# EasyEDA schematic SCH_Nucleo扩展板_DAC8830_ADS8681_2022-10-27.json

## Sheets
1 连接器: TITLE: Sheet_1; REV: 1.0; Date: 2022-09-22; Sheet: 1/1; Company: Your Company
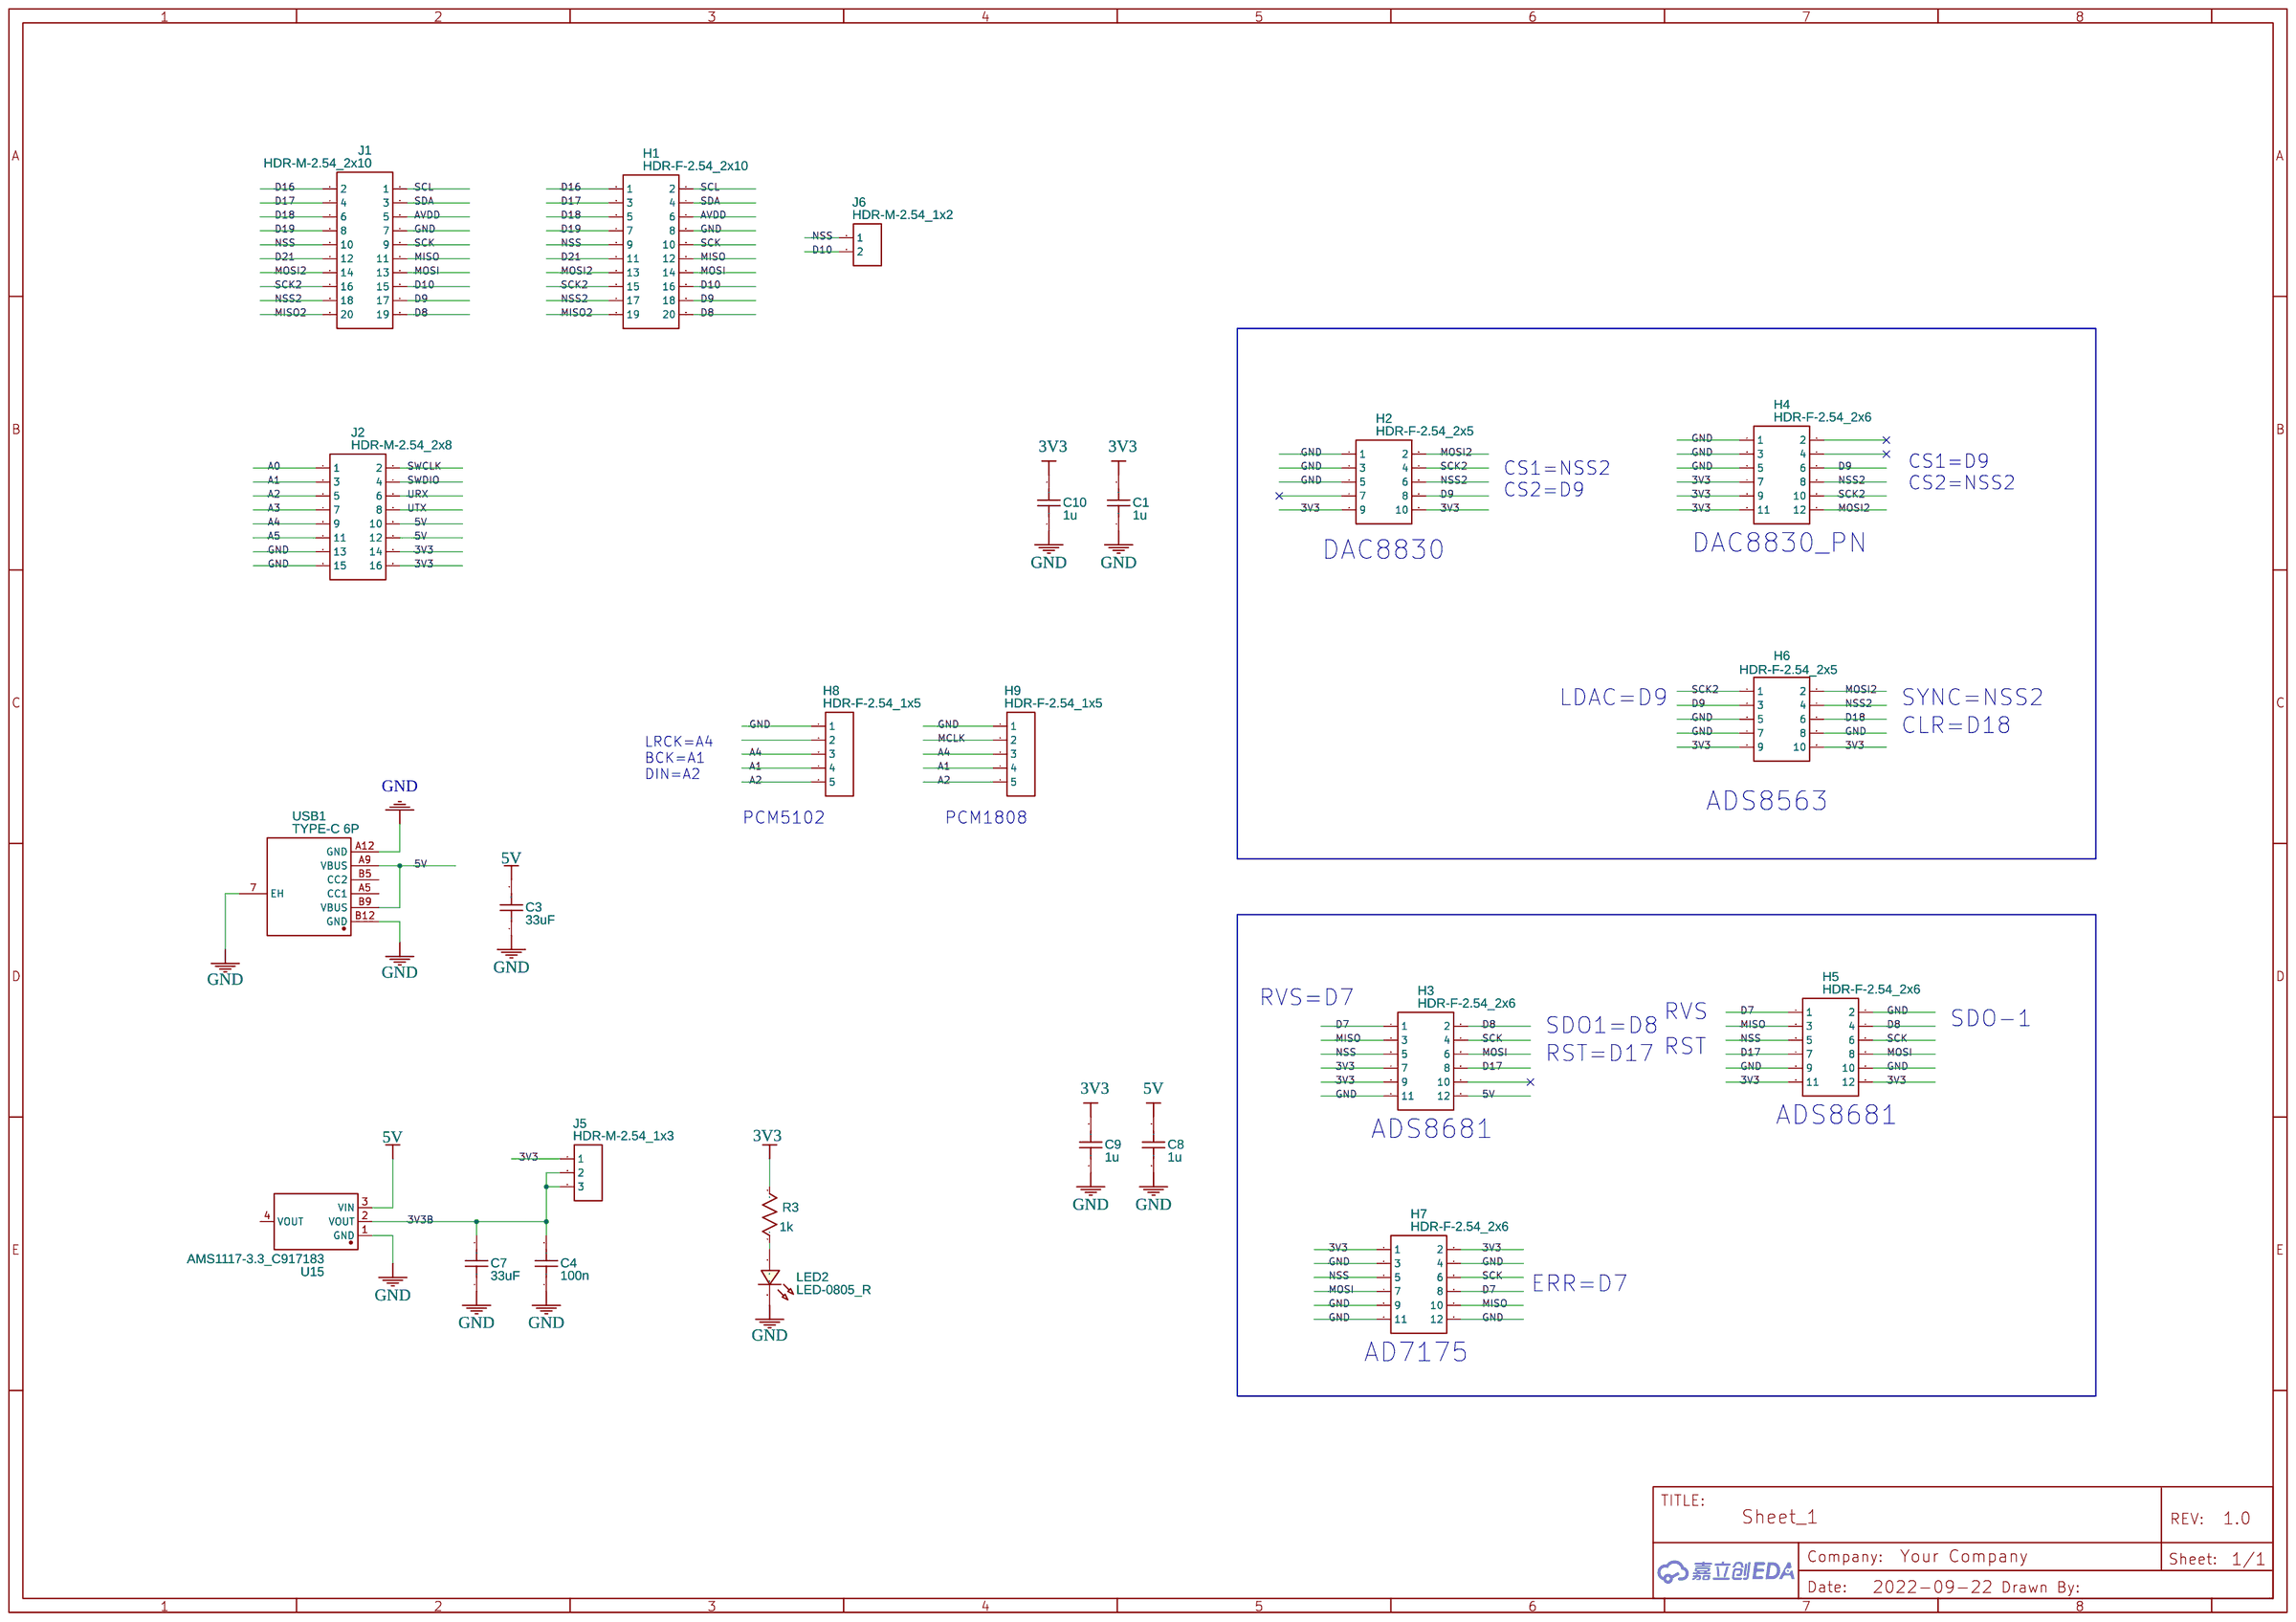
[diagram p0: 连接器]
2 mcu: TITLE: Sheet_3; Date: 2022-09-29
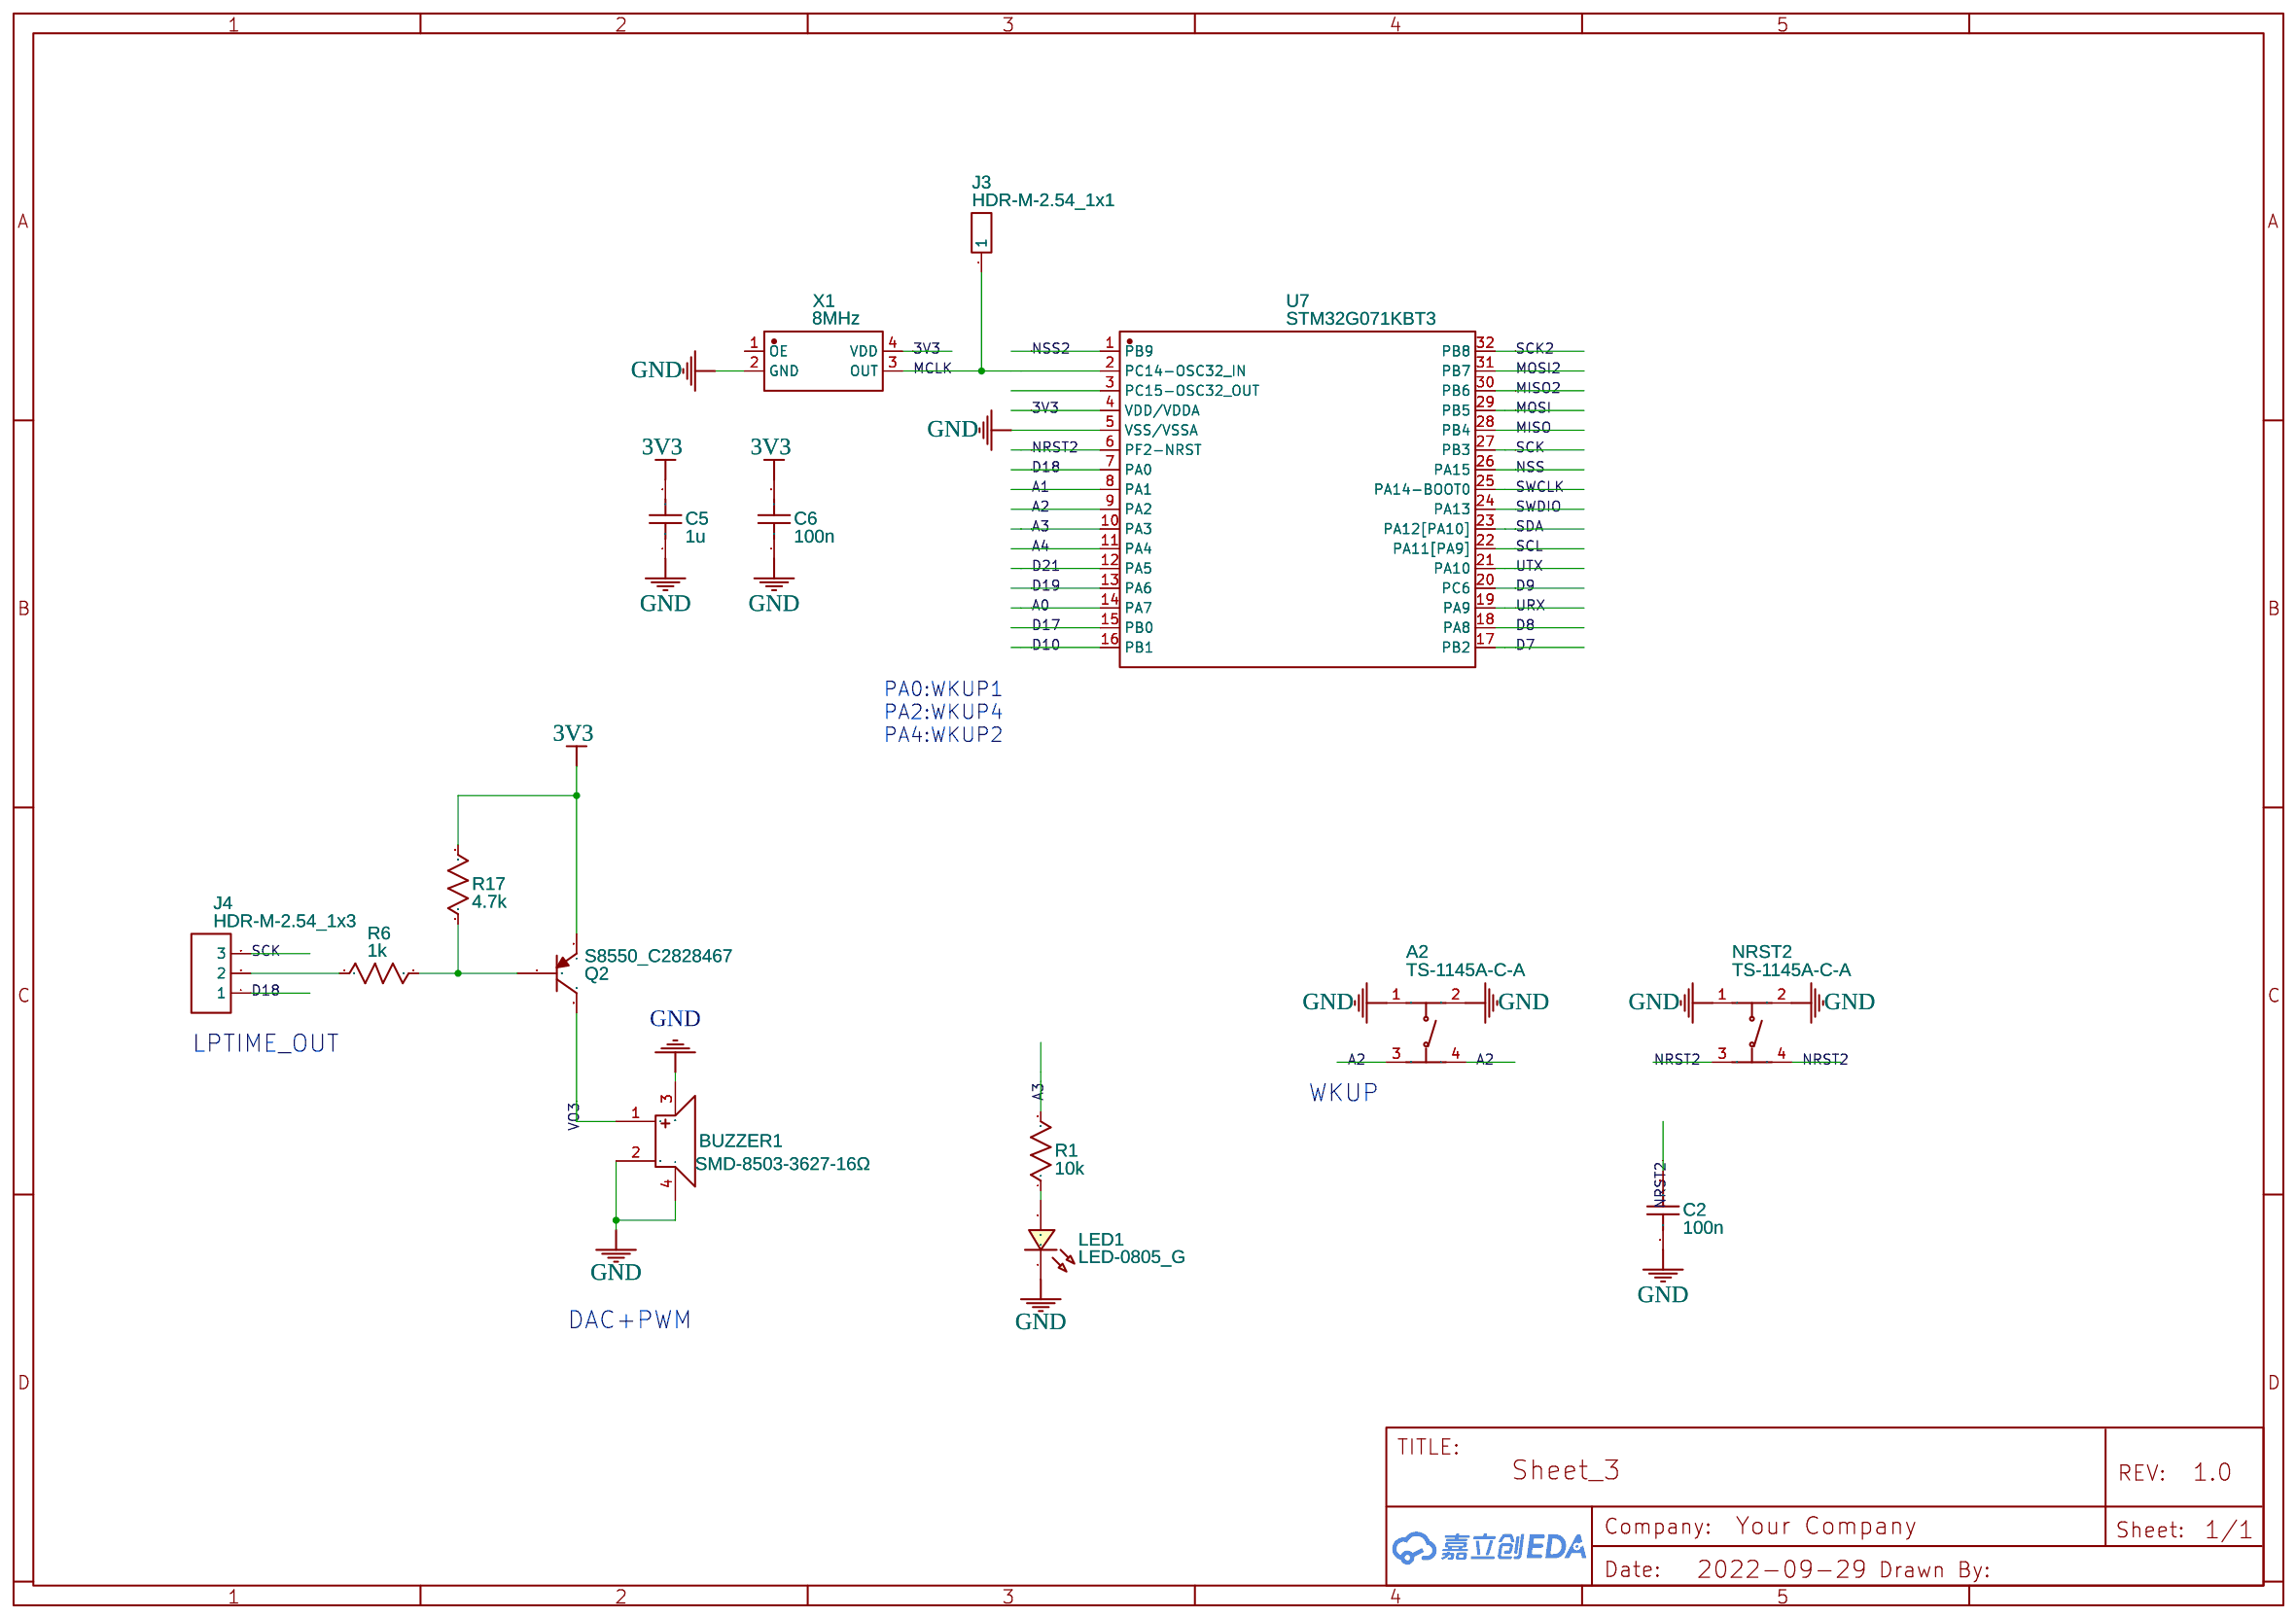
[diagram p1: mcu]

## Parts
sheet mcu
A2  TS-1145A-C-A  [SW-SMD_4P-L4.2-W3.2-P2.15-LS4.6]
BUZZER1  SMD-8503-3627-16Ω  [BUZ-SMD_4P-L8.5-W8.5-BR-1]
C2  100n  [C0805]
C5  1u  [C0805]
C6  100n  [C0805]
J3  HDR-M-2.54_1x1  [HDR-M-2.54_1X1]
J4  HDR-M-2.54_1x3  [HDR-M-2.54_1X3]
LED1  LED-0805_G  [LED0805_GREEN]
NRST2  TS-1145A-C-A  [SW-SMD_4P-L4.2-W3.2-P2.15-LS4.6]
Q2  S8550_C2828467  [SOT-23-3_L2.9-W1.3-P1.90-LS2.4-BR]
R1  10k  [R0805]
R6  1k  [R0805]
R17  4.7k  [R0805]
U7  STM32G071KBT3  [LQFP-32_L7.0-W7.0-P0.80-LS9.0-BL]
X1  8MHz  [OSC-SMD_4P-L2.5-W2.0-BL]
sheet 连接器
C1  1u  [C0805]
C3  33uF  [C1210]
C4  100n  [C0805]
C7  33uF  [C1210]
C8  1u  [C0805]
C9  1u  [C0805]
C10  1u  [C0805]
H1  HDR-F-2.54_2x10  [HDR-F-2.54_2X10]
H2  HDR-F-2.54_2x5  [HDR-F-2.54_2X5]
H3  HDR-F-2.54_2x6  [HDR-F-2.54_2X6]
H4  HDR-F-2.54_2x6  [HDR-F-2.54_2X6]
H5  HDR-F-2.54_2x6  [HDR-F-2.54_2X6]
H6  HDR-F-2.54_2x5  [HDR-F-2.54_2X5]
H7  HDR-F-2.54_2x6  [HDR-F-2.54_2X6]
H8  HDR-F-2.54_1x5  [HDR-F-2.54_1X5]
H9  HDR-F-2.54_1x5  [HDR-F-2.54_1X5]
J1  HDR-M-2.54_2x10  [HDR-M-2.54_2X10]
J2  HDR-M-2.54_2x8  [HDR-M-2.54_2X8]
J5  HDR-M-2.54_1x3  [HDR-M-2.54_1X3]
J6  HDR-M-2.54_1x2  [HDR-M-2.54_1X2]
LED2  LED-0805_R  [LED0805_RED]
R3  1k  [R0805]
U15  AMS1117-3.3_C917183  [SOT-223-3_L6.7-W3.7-P2.30-LS7.0-BR]
USB1  TYPE-C 6P  [TYPE-C-SMD_TYPE-C-6P]

## Library data of the parts
A2 NRST2 = TS-1145A-C-A: Supplier: LCSC; Supplier Part: C318903; Manufacturer: XKB Enterprise; Contributor: LCSC; JLCPCB Part Class: Extended Part
BUZZER1 = SMD-8503-3627-16Ω: Supplier: LCSC; Supplier Part: C2685545; Manufacturer: S&S; Contributor: LCSC; JLCPCB Part Class: Extended Part
C1 C2 C5 C6 C8-C10 = C_0805_US: Supplier Part: C2913555; Supplier: LCSC; Contributor: LCEDA_Lib; Manufacturer Part: 0805B105M500NT; Manufacturer: FH(风华)
J3 = HDR-M-2.54_1x1: Supplier Part: C81276; Supplier: LCSC; Contributor: LCEDA_Lib
J4 J5 = HDR-M-2.54_1x3: Supplier Part: C180248; Supplier: LCSC; Contributor: LCEDA_Lib
LED1 = LED-0805_G: Manufacturer: 国星光电; Manufacturer Part: NCD0805G1; Supplier Part: C84260; Contributor: LCEDA_Lib
Q2 = S8550_C2828467: Supplier: LCSC; Supplier Part: C2828467; Manufacturer: CBI(创基); Manufacturer Part: S8550; Contributor: LCSC; JLCPCB Part Class: Extended Part
R1 R3 = R_0805_US: Supplier Part: C75781; Supplier: LCSC; Contributor: LCEDA_Lib; Manufacturer Part: TC0525F1001T5E; Manufacturer: UniOhm
R6 R17 = R_0805_US: Contributor: LCEDA_Lib
U7 = STM32G071KBT3: Supplier: LCSC; Supplier Part: C724238; Manufacturer: STMicroelectronics; Contributor: LCSC; JLCPCB Part Class: Extended Part
X1 = S2H008000I3CHE-T: Supplier: LCSC; Supplier Part: C253908; Manufacturer: Harmony Elec; Contributor: LCSC; JLCPCB Part Class: Extended Part
C3 C7 = C3225X5R0J336MT0A0N: Supplier: LCSC; Supplier Part: C695362; Manufacturer: TDK; Contributor: LCSC; JLCPCB Part Class: Extended Part
C4 = C_0805_US: Supplier: LCSC; Contributor: LCEDA_Lib
H1 = HDR-F-2.54_2x10: Supplier Part: C30867; Supplier: LCSC; Contributor: LCEDA_Lib
H2 H6 = HDR-F-2.54_2x5: Supplier Part: C30419; Supplier: LCSC; Contributor: LCEDA_Lib
H3-H5 H7 = HDR-F-2.54_2x6: Supplier Part: C36191; Supplier: LCSC; Contributor: LCEDA_Lib
H8 H9 = HDR-F-2.54_1x5: Supplier Part: C50950; Supplier: LCSC; Contributor: LCEDA_Lib
J1 = HDR-M-2.54_2x10: Supplier Part: C124359; Supplier: LCSC; Contributor: LCEDA_Lib
J2 = HDR-M-2.54_2x8: Supplier Part: C68234; Supplier: LCSC; Contributor: LCEDA_Lib
J6 = HDR-M-2.54_1x2: Supplier Part: C124375; Supplier: LCSC; Contributor: LCEDA_Lib
LED2 = LED-0805_R: Manufacturer: EVERLIGHT(台湾亿光); Manufacturer Part: 17-21SURC/S530-A3/TR8; Supplier Part: C72037; Contributor: LCEDA_Lib
U15 = AMS1117-3.3_C917183: Supplier: LCSC; Supplier Part: C917183; Manufacturer: JSMSEMI; Manufacturer Part: AMS1117-3.3; Contributor: LCSC; JLCPCB Part Class: Extended Part
USB1 = TYPE-C 6P: Supplier: LCSC; Supplier Part: C456012; Manufacturer: SHOU HAN; Contributor: LCSC; JLCPCB Part Class: Extended Part

## Nets
3V3: C1.2 C5.2 C6.2 C9.2 C10.2 H2.9 H2.10 H3.7 H3.9 H4.7 H4.9 H4.11 H5.11 H5.12 H6.9 H6.10 H7.1 H7.2 J2.14 J2.16 J5.1 Q2.2(E) R3.2 R17.2 U7.4(VDD/VDDA) X1.4(VDD)
3V3B: C4.2 C7.2 J5.2 J5.3 U15.2(VOUT)
5V: C3.2 C8.2 H3.12 J2.10 J2.12 U15.3(VIN) USB1.A9(VBUS) USB1.B9(VBUS)
AVDD: H1.6 J1.5
GND: A2.1 A2.2 BUZZER1.2 BUZZER1.3 BUZZER1.4 C1.1 C2.1 C3.1 C4.1 C5.1 C6.1 C7.1 C8.1 C9.1 C10.1 H1.8 H2.1 H2.3 H2.5 H3.11 H4.1 H4.3 H4.5 H5.2 H5.9 H5.10 H6.5 H6.7 H6.8 H7.3 H7.4 H7.9 H7.11 H7.12 H8.1 H9.1 J1.7 J2.13 J2.15 LED1.2 LED2.2 NRST2.1 NRST2.2 U7.5(VSS/VSSA) U15.1(GND) USB1.7(EH) USB1.A12(GND) USB1.B12(GND) X1.2(GND)
A0: J2.1 U7.14(PA7)
A1: H8.4 H9.4 J2.3 U7.8(PA1)
A2: A2.3 A2.4 H8.5 H9.5 J2.5 U7.9(PA2)
A3: J2.7 R1.2 U7.10(PA3)
A4: H8.3 H9.3 J2.9 U7.11(PA4)
A5: J2.11
D7: H3.1 H5.1 H7.8 U7.17(PB2)
D8: H1.20 H3.2 H5.4 J1.19 U7.18(PA8)
D9: H1.18 H2.8 H4.6 H6.3 J1.17 U7.20(PC6)
D10: H1.16 J1.15 J6.2 U7.16(PB1)
D16: H1.1 J1.2
D17: H1.3 H3.8 H5.7 J1.4 U7.15(PB0)
D18: H1.5 H6.6 J1.6 J4.1 U7.7(PA0)
D19: H1.7 J1.8 U7.13(PA6)
D21: H1.11 J1.12 U7.12(PA5)
MCLK: H9.2 J3.1 U7.2(PC14-OSC32_IN) X1.3(OUT)
MISO: H1.12 H3.3 H5.3 H7.10 J1.11 U7.28(PB4)
MISO2: H1.19 J1.20 U7.30(PB6)
MOSI: H1.14 H3.6 H5.8 H7.7 J1.13 U7.29(PB5)
MOSI2: H1.13 H2.2 H4.12 H6.2 J1.14 U7.31(PB7)
NRST2: C2.2 NRST2.3 NRST2.4 U7.6(PF2-NRST)
NSS: H1.9 H3.5 H5.5 H7.5 J1.10 J6.1 U7.26(PA15)
NSS2: H1.17 H2.6 H4.8 H6.4 J1.18 U7.1(PB9)
SCK: H1.10 H3.4 H5.6 H7.6 J1.9 J4.3 U7.27(PB3)
SCK2: H1.15 H2.4 H4.10 H6.1 J1.16 U7.32(PB8)
SCL: H1.2 J1.1 U7.22(PA11[PA9])
SDA: H1.4 J1.3 U7.23(PA12[PA10])
SWCLK: J2.2 U7.25(PA14-BOOT0)
SWDIO: J2.4 U7.24(PA13)
URX: J2.6 U7.19(PA9)
UTX: J2.8 U7.21(PA10)
VO3: BUZZER1.1 Q2.3(C)
Net-(J4-2): J4.2 R6.1
Net-(LED1-1): LED1.1 R1.1
Net-(LED2-1): LED2.1 R3.1
Net-(Q2-1): Q2.1(B) R6.2 R17.1

Not connected (* = marked no-connect by the designer): H2 7; H3 10; H4 2 4; H8 2; U7 3(PC15-OSC32_OUT); U15 4(VOUT); USB1 A5(CC1) B5(CC2); X1 1(OE)

## Notes on the sheets
sheet 1
- CS1=D9
  CS2=NSS2
- CS1=NSS2
  CS2=D9
- DAC8830
- DAC8830_PN
- LDAC=D9
- SYNC=NSS2
- CLR=D18
- LRCK=A4
  BCK=A1
  DIN=A2
- ADS8563
- PCM5102
- PCM1808
- RVS=D7
- RVS
- SDO1=D8
- SDO-1
- RST=D17
- RST
- ADS8681
- ADS8681
- ERR=D7
- AD7175
sheet 2
- PA0:WKUP1
  PA2:WKUP4
  PA4:WKUP2
- LPTIME_OUT
- WKUP
- DAC+PWM
